# Altium schematic sheet touch-24.SchDoc
size A3; SPICEModelCacheRLVYLVLF: <root> / <DocumentId>RLVYLVLF</DocumentId> / <CacheFrame Number="0"> / <Model Name="qnpn" Kind="MDL"> / <Text>*QNPN / *NPN Trans Pinout: C,B,E / .MODEL QNPN NPN(IS=3.2E-16 BF=141 VAF=35 ISE=2.6 NE=1.46 CJE=1E-13 / + MJE=0.333 TF=6E-11 CJC=1E-13 CJS=2.2E-13 MJS=0.5 FC=0.67 )</Text> / </Model> / <Model Name="dtunnel1" Kind="CKT"> / <Text>*Tunnel Diode Default / *MCE 600V 50A 27.2ns default parameters / *Diode Pinout: A,K / * Parameters: / * RS:  Series resistance value / * RP:  Negative resistance value in parallel with capacitance. / * CP:   Capacitance value in parallel with negative resistance. / * LS:  Series inductance value. / * / * / .SUBCKT DTUNNEL1 1 2 PARAMS: Rs=6 Rp=-75 Cp=0.6E-12 Ls=0.1nH / RS  1 3  {Rs} / RP  3 4  {Rp} / CP  3 4  {Cp} / LS  4 2  {Ls} / .ENDS DTUNNEL1</Text> / </Model> / <Model Name="pmos" Kind="MDL"> / <Text>*Default P-Channel MOSFET / *Pinout: D,G,S / .MODEL PMOS PMOS()</Text> / </Model> / <Model Name="pnp" Kind="MDL"> / <Text>*Default PNP BJT / *PNP Trans Pinout: C,B,E / .MODEL PNP PNP()</Text> / </Model> / </CacheFrame> / </root>
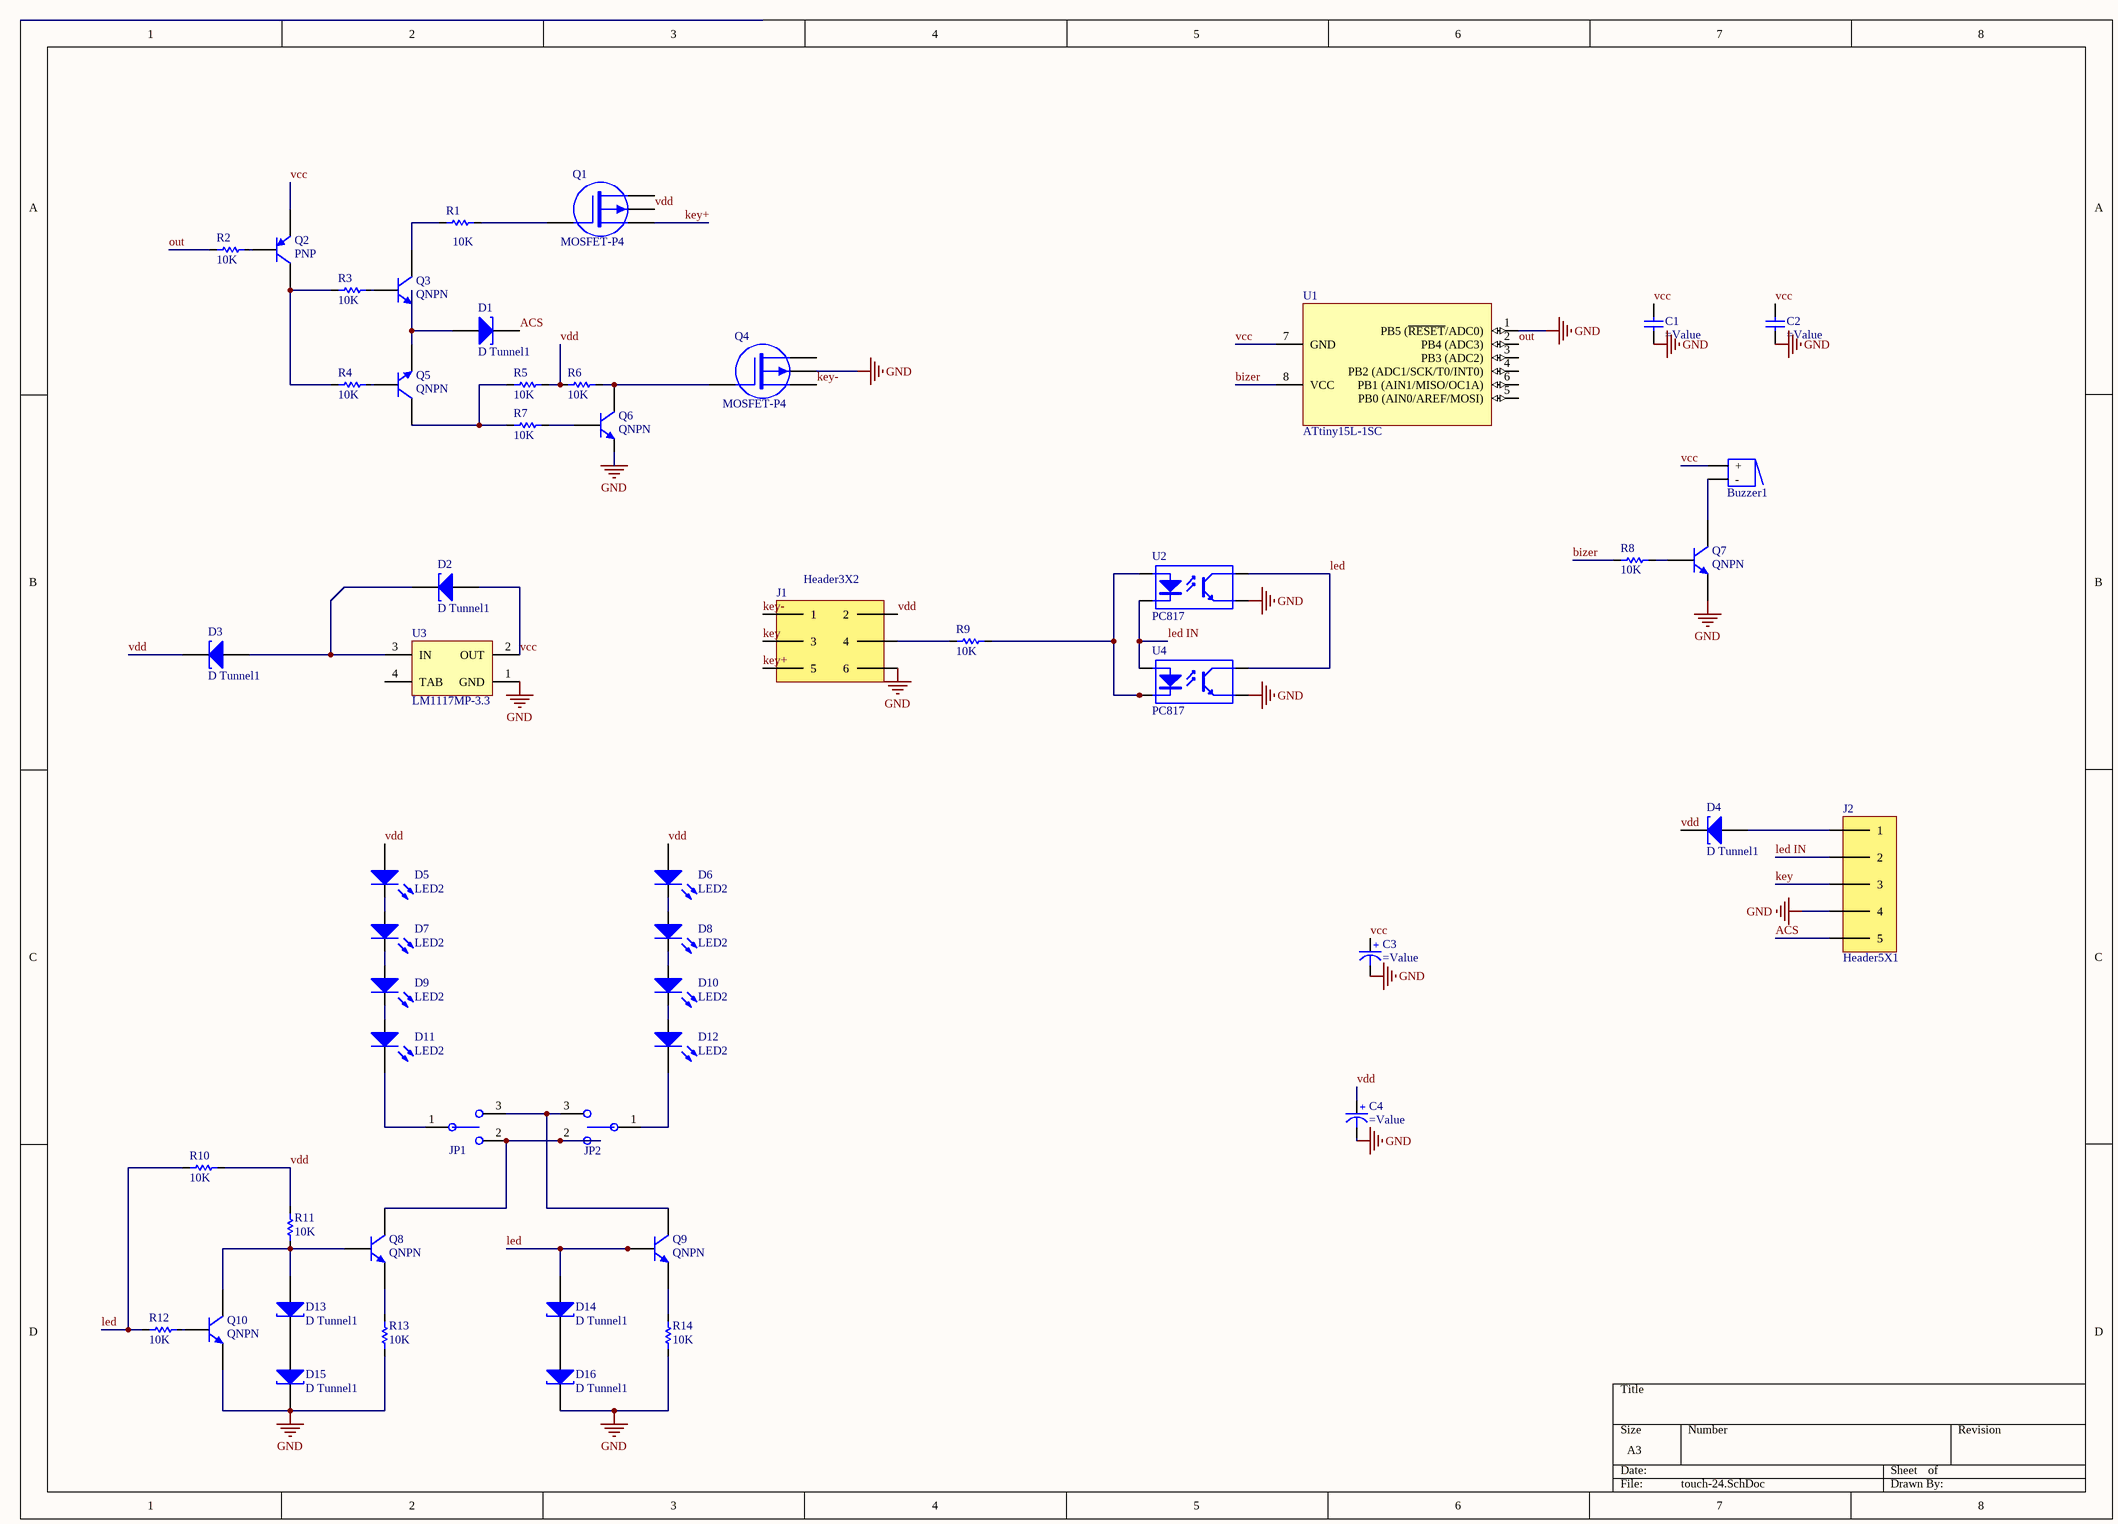
[diagram p0: touch-24.SchDoc]

## Parts
Buzzer1  Buzzer  [BUZZER]  (value not drawn)
C1  (no value)  [CAP 1206]
C2  (no value)  [CAP 1206]
C3  (no value)  [ELEC-CAP-RAD10-20]
C4  (no value)  [ELEC-CAP-RAD15-30]
D1  D Tunnel1  [3.2X1.6X1.1]
D2  D Tunnel1  [3.2X1.6X1.1]
D3  D Tunnel1  [3.2X1.6X1.1]
D4  D Tunnel1  [3.2X1.6X1.1]
D5  LED2  [3.2X1.6X1.1]
D6  LED2  [3.2X1.6X1.1]
D7  LED2  [3.2X1.6X1.1]
D8  LED2  [3.2X1.6X1.1]
D9  LED2  [3.2X1.6X1.1]
D10  LED2  [3.2X1.6X1.1]
D11  LED2  [3.2X1.6X1.1]
D12  LED2  [3.2X1.6X1.1]
D13  D Tunnel1  [3.2X1.6X1.1]
D14  D Tunnel1  [3.2X1.6X1.1]
D15  D Tunnel1  [3.2X1.6X1.1]
D16  D Tunnel1  [3.2X1.6X1.1]
J1  Header3X2  [HEADER 3X2]
J2  Header5X1  [HEADER 5X1]
JP1  Jumper Selector  [Jumper Selector]  (value not drawn)
JP2  Jumper Selector  [Jumper Selector]  (value not drawn)
Q1  MOSFET-P4  [SOT223_N]
Q2  PNP  [SOT-23B_N]
Q3  QNPN  [SOT-23B_L]
Q4  MOSFET-P4  [SOT223_N]
Q5  QNPN  [SOT-23B_L]
Q6  QNPN  [SOT-23B_L]
Q7  QNPN  [SOT-23B_L]
Q8  QNPN  [SOT-23B_L]
Q9  QNPN  [SOT-23B_L]
Q10  QNPN  [SOT-23B_L]
R1  10K  [RES 1206 (3216X08L)]
R2  10K  [RES 1206 (3216X08L)]
R3  10K  [RES 1206 (3216X08L)]
R4  10K  [RES 1206 (3216X08L)]
R5  10K  [RES 1206 (3216X08L)]
R6  10K  [RES 1206 (3216X08L)]
R7  10K  [RES 1206 (3216X08L)]
R8  10K  [RES 1206 (3216X08L)]
R9  10K  [RES 1206 (3216X08L)]
R10  10K  [RES 1206 (3216X08L)]
R11  10K  [RES 1206 (3216X08L)]
R12  10K  [RES 1206 (3216X08L)]
R13  10K  [RES 1206 (3216X08L)]
R14  10K  [RES 1206 (3216X08L)]
U1  ATtiny15L-1SC  [8S2_N]
U2  PC817  [DIP4]
U3  LM1117MP-3.3  [SOT89L]
U4  PC817  [DIP4]

## Nets
GND: C1.1(+) C2.1(+) C3.1(-) C4.1(-) D15.2(K) D16.2(K) J1.6 J2.4 Q4.3(U) Q6.3(E) Q7.3(E) Q10.3(E) R13.1 R14.1 U1.1(PB5_(~{RESET}/ADC0)) U2.3(E) U3.1(GND) U4.3(E)
ACS: D1.2(K) J2.5
bizer: R8.1 U1.8(VCC)
key: J1.3 J2.3
key+: J1.5 Q1.4(S)
key-: J1.1 Q4.4(S)
led: D14.1(A) Q9.2(B) R10.1 R12.1 U2.4(C) U4.4(C)
led IN: J2.2 U2.2(K) U4.1(A)
out: R2.1 U1.2(PB4_(ADC3))
vcc: Buzzer1.1(+) C1.2(-) C2.2(-) C3.2(+) D2.1(A) Q2.3(E) U1.7(GND) U3.2(OUT)
vdd: C4.2(+) D3.2(K) D4.2(K) D5.1(A) D6.1(A) J1.2 Q1.3(U) R5.2 R6.1 R10.2 R11.2
NetBuzzer1_2: Buzzer1.2(-) Q7.1(C)
NetD1_1: D1.1(A) Q3.3(E) Q5.3(E)
NetD2_2: D2.2(K) D3.1(A) U3.3(IN)
NetD4_1: D4.1(A) J2.1
NetD5_2: D5.2(K) D7.1(A)
NetD6_2: D6.2(K) D8.1(A)
NetD7_2: D7.2(K) D9.1(A)
NetD8_2: D8.2(K) D10.1(A)
NetD9_2: D9.2(K) D11.1(A)
NetD10_2: D10.2(K) D12.1(A)
NetD11_2: D11.2(K) JP1.1
NetD12_2: D12.2(K) JP2.1
NetD13_1: D13.1(A) Q8.2(B) Q10.1(C) R11.1
NetD13_2: D13.2(K) D15.1(A)
NetD14_2: D14.2(K) D16.1(A)
NetJ1_4: J1.4 R9.1
NetJP1_2: JP1.2 JP2.2 Q8.1(C)
NetJP1_3: JP1.3 JP2.3 Q9.1(C)
NetQ1_1: Q1.1(G) R1.2
NetQ2_1: Q2.1(C) R3.1 R4.1
NetQ2_2: Q2.2(B) R2.2
NetQ3_1: Q3.1(C) R1.1
NetQ3_2: Q3.2(B) R3.2
NetQ4_1: Q4.1(G) Q6.1(C) R6.2
NetQ5_1: Q5.1(C) R5.1 R7.1
NetQ5_2: Q5.2(B) R4.2
NetQ6_2: Q6.2(B) R7.2
NetQ7_2: Q7.2(B) R8.2
NetQ8_3: Q8.3(E) R13.2
NetQ9_3: Q9.3(E) R14.2
NetQ10_2: Q10.2(B) R12.2
NetR9_2: R9.2 U2.1(A) U4.2(K)

Not connected (* = marked no-connect by the designer): Q1 2(D); Q4 2(D); U1 3(PB3_(ADC2)) 4(PB2_(ADC1/SCK/T0/INT0)) 5(PB0_(AIN0/AREF/MOSI)) 6(PB1_(AIN1/MISO/OC1A)); U3 4(TAB)

## Library data of the parts
Buzzer1 = Buzzer: Designer: Seyed Mohsen Ghasemain; ComponentLinkURL: www.picpars.com
C1 C2 = Capacitor
C3 C4 = Capacitor Electrolytic: Electrolytic Capacitor
D1-D4 D13-D16 = D Tunnel1: Tunnel Diode - RLC Model; Published: 8-Jun-2000; LatestRevisionDate: 17-Jul-2002; LatestRevisionNote: Re-released for DXP Platform.; PackageVersion: Feb-2002; PackageReference: 3.2X1.6X1.1; Publisher: Altium Limited; PackageDescription: SM LED; 2 Flat Leads
D5-D12 = LED2: Typical RED, GREEN, YELLOW, AMBER GaAs LED; Published: 8-Jun-2000; LatestRevisionDate: 17-Jul-2002; LatestRevisionNote: Re-released for DXP Platform.; PackageVersion: Feb-2002; PackageReference: 3.2X1.6X1.1; Publisher: Altium Limited; PackageDescription: SM LED; 2 Flat Leads
Q1 Q4 = MOSFET-P4: P-Channel MOSFET, Externally Terminated Substrate; Published: 24-Mar-1999; LatestRevisionDate: 29-May-2009; LatestRevisionNote: IPC-7351 Footprint Added.; PackageVersion: 2002; PackageReference: SOT223; Publisher: Altium Limited; PackageDescription: 4-Pin SOT-223 Package 2.3 mm Pitch, 7 mm Lead Span; Code_JEITA: SC-75; Code_JEDEC: TO-261-AA-B; Code_IPC: SOT223-4
Q2 = PNP: PNP Bipolar Transistor; pin to pad: 1>3 2>1 3>2; Published: 8-Jun-2000; LatestRevisionDate: 29-May-2009; LatestRevisionNote: IPC-7351 Footprint Added.; PackageVersion: Aug-1999; PackageReference: SOT-23B; Publisher: Altium Limited; PackageDescription: 3-Pin SOT-23 Package 0.95 mm Pitch, 2.4 mm Lead Span
Q3 Q5-Q10 = QNPN: NPN Bipolar Transistor; pin to pad: 1>3 2>1 3>2; Published: 8-Jun-2000; LatestRevisionDate: 29-May-2009; LatestRevisionNote: IPC-7351 Footprint Added.; PackageVersion: Aug-1999; PackageReference: SOT-23B; Publisher: Altium Limited; PackageDescription: 3-Pin SOT-23 Package 0.95 mm Pitch, 2.4 mm Lead Span
R1-R14 = Resistor: Tolerance: 5%; Power: 1/4 W; Value: 10K
U1 = ATtiny15L-1SC: 8-Bit AVR Microcontroller with 1K Byte of Flash Memory; pin to pad: 1>7 7>8 8>1; Published: 17-Sep-2003; LatestRevisionDate: 16-Oct-2006; LatestRevisionNote: IPC-7351 Footprint Added.; DatasheetVersion: 1187E-AVR-06/02; PackageVersion: revF, Apr-2008; PackageReference: 8S2; Publisher: Altium Limited; PackageDescription: 8-Lead, 0.208" Body, Plastic Small Outline Package (EIAJ); Supplier 1: Digi-Key; Supplier Part Number 1: ATTINY15L-1SC-ND; Supplier 2: Mouser; Supplier Part Number 2: 556-ATTINY15L1SC; ComponentLink1Description: Datasheet; ComponentLink1URL: http://www.atmel.com/dyn/resources/prod_documents/doc1187.pdf; ComponentLink2Description: Atmel.com Home; ComponentLink2URL: http://www.atmel.com
U2 U4 = OPTCOUPLER_01: 4-Pin Phototransistor Optocoupler
U3 = LM1117MP-3.3: 800mA Low-Dropout Linear Regulator; pin to pad: 1>2 2>1; Manufacturer: National Semiconductor; CompType: LDO IC; PackageTopMarking: XYTT*N05A; PowerWise: N; Published: 4-Dec-2008; DatasheetVersion: Apr-2006; PackageVersion: revB, Apr-2003; PackageReference: MP04A; Publisher: Altium Limited; PackageDescription: Molded SOT-223, 6.50 x 3.56 x 1.6mm Body, 4 Lead, 2.3mm Pitch; PartNumber: LM1117MP-3.3; RoHS: O; PinCount: 4; DigiKeyPartNumber: LM1117MP-3.3CT-ND; Code_JEDEC: TO-261-AA; Code_IPC: SOT223-4; ComponentLink1Description: LM1117 Datasheet; ComponentLink1URL: http://www.national.com/ds/LM/LM1117.pdf; ComponentLink2Description: LM1117 Web Page; ComponentLink2URL: http://www.national.com/pf/LM/LM1117.html; ComponentLink3Description: MP04A Package Page; ComponentLink3URL: http://www.national.com/packaging/folders/mp04a.html